# Altium schematic sheet SHARP_GP2AP03VT00F_V0.2_20200112.SchDoc
size A4
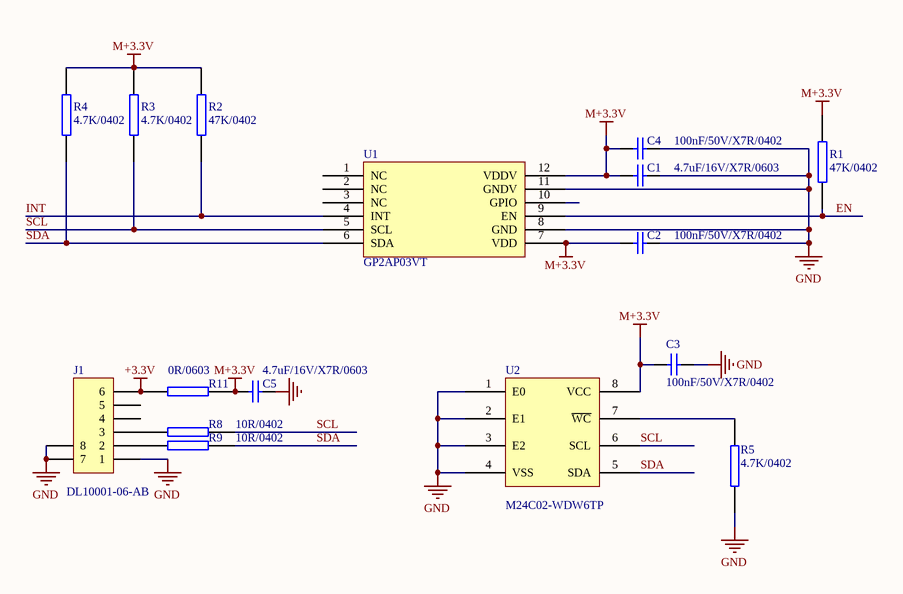
[diagram p0: SHARP_GP2AP03VT00F_V0.2_20200112.SchDoc]

## Parts
C1  value 4.7uF/16V/X7R/0603  [CAP-CC0603]  (hidden comment: Cap)
C2  value 100nF/50V/X7R/0402  [CAP-CC0402]  (hidden comment: Cap)
C3  value 100nF/50V/X7R/0402  [CAP-CC0402]  (hidden comment: Cap)
C4  value 100nF/50V/X7R/0402  [CAP-CC0402]  (hidden comment: Cap)
C5  value 4.7uF/16V/X7R/0603  [CAP-CC0603]  (hidden comment: Cap)
J1  value DL10001-06-AB  [A1001AWV-06]  (hidden comment: CONNECT)
R1  value 47K/0402  [RES-RC0402]  (hidden comment: RES)
R2  value 47K/0402  [RES-RC0402]  (hidden comment: RES)
R3  value 4.7K/0402  [RES-RC0402]  (hidden comment: RES)
R4  value 4.7K/0402  [RES-RC0402]  (hidden comment: RES)
R5  value 4.7K/0402  [RES-RC0402]  (hidden comment: RES)
R8  value 10R/0402  [RES-RC0402]  (hidden comment: RES)
R9  value 10R/0402  [RES-RC0402]  (hidden comment: RES)
R11  value 0R/0603  [RES-RC0603]  (hidden comment: RES)
U1  value GP2AP03VT  [SHARP_GP2AP03VT00F]  (hidden comment: IC)
U2  value M24C02-WDW6TP  [TSSOP-8]  (hidden comment: IC)

## Nets
+3.3V: J1.6 R11.1
GND: C1.2 C2.2 C3.2 C4.2 C5.2 J1.1 J1.7 J1.8 R5.2 U1.8(GND) U1.11(GNDV) U2.1(E0) U2.2(E1) U2.3(E2) U2.4(VSS)
M+3.3V: C1.1 C2.1 C3.1 C4.1 C5.1 R1.1 R2.1 R3.1 R4.1 R11.2 U1.7(VDD) U1.12(VDDV) U2.8(VCC)
EN: R1.2 U1.9(EN)
INT: R2.2 U1.4(INT)
SCL: R3.2 R8.2 U1.5(SCL) U2.6(SCL)
SDA: R4.2 R9.2 U1.6(SDA) U2.5(SDA)
NetJ1_2: J1.2 R9.1
NetJ1_3: J1.3 R8.1
NetR5_1: R5.1 U2.7(~{WC})

Not connected (* = marked no-connect by the designer): J1 4 5; U1 1(NC) 2(NC) 3(NC) 10(GPIO)

## Library data of the parts
C1 C5 = Cap: CAP CER 4.7uF 16V 10% X7R 0603; Vendor: YAGEO/WALSIN/TDK/SAMSUNG/MURATA
C2-C4 = Cap: CAP CER 100nF 50V 10% X7R 0402; Vendor: YAGEO/WALSIN/TDK/SAMSUNG/MURATA
J1 = CON6: SMT Header 6-Pin 1.0mm white VT; Vendor: 德利
R1 R2 = RES2: RES MF 47K 1/16W 5% 0402; Vendor: YAGEO/WALSIN/TDK/SAMSUNG/MURATA
R3-R5 = RES2: RES MF 4.7K 1/16W 5% 0402; Vendor: YAGEO/WALSIN/TDK/SAMSUNG/MURATA
R8 R9 R11 = RES2: RES MF 10R 1/16W 5% 0402; Vendor: YAGEO/WALSIN/TDK/SAMSUNG/MURATA
U1 = GP2AP03VT: Vendor: SHARP
U2 = Component_1: EEPROM,M24C02-WDW6TP,2K,TSSOP-8; Vendor: ST